# EAGLE schematic real_onboard_v8_v7 (EAGLE 9.7.0)

## Sheet 1 of 2
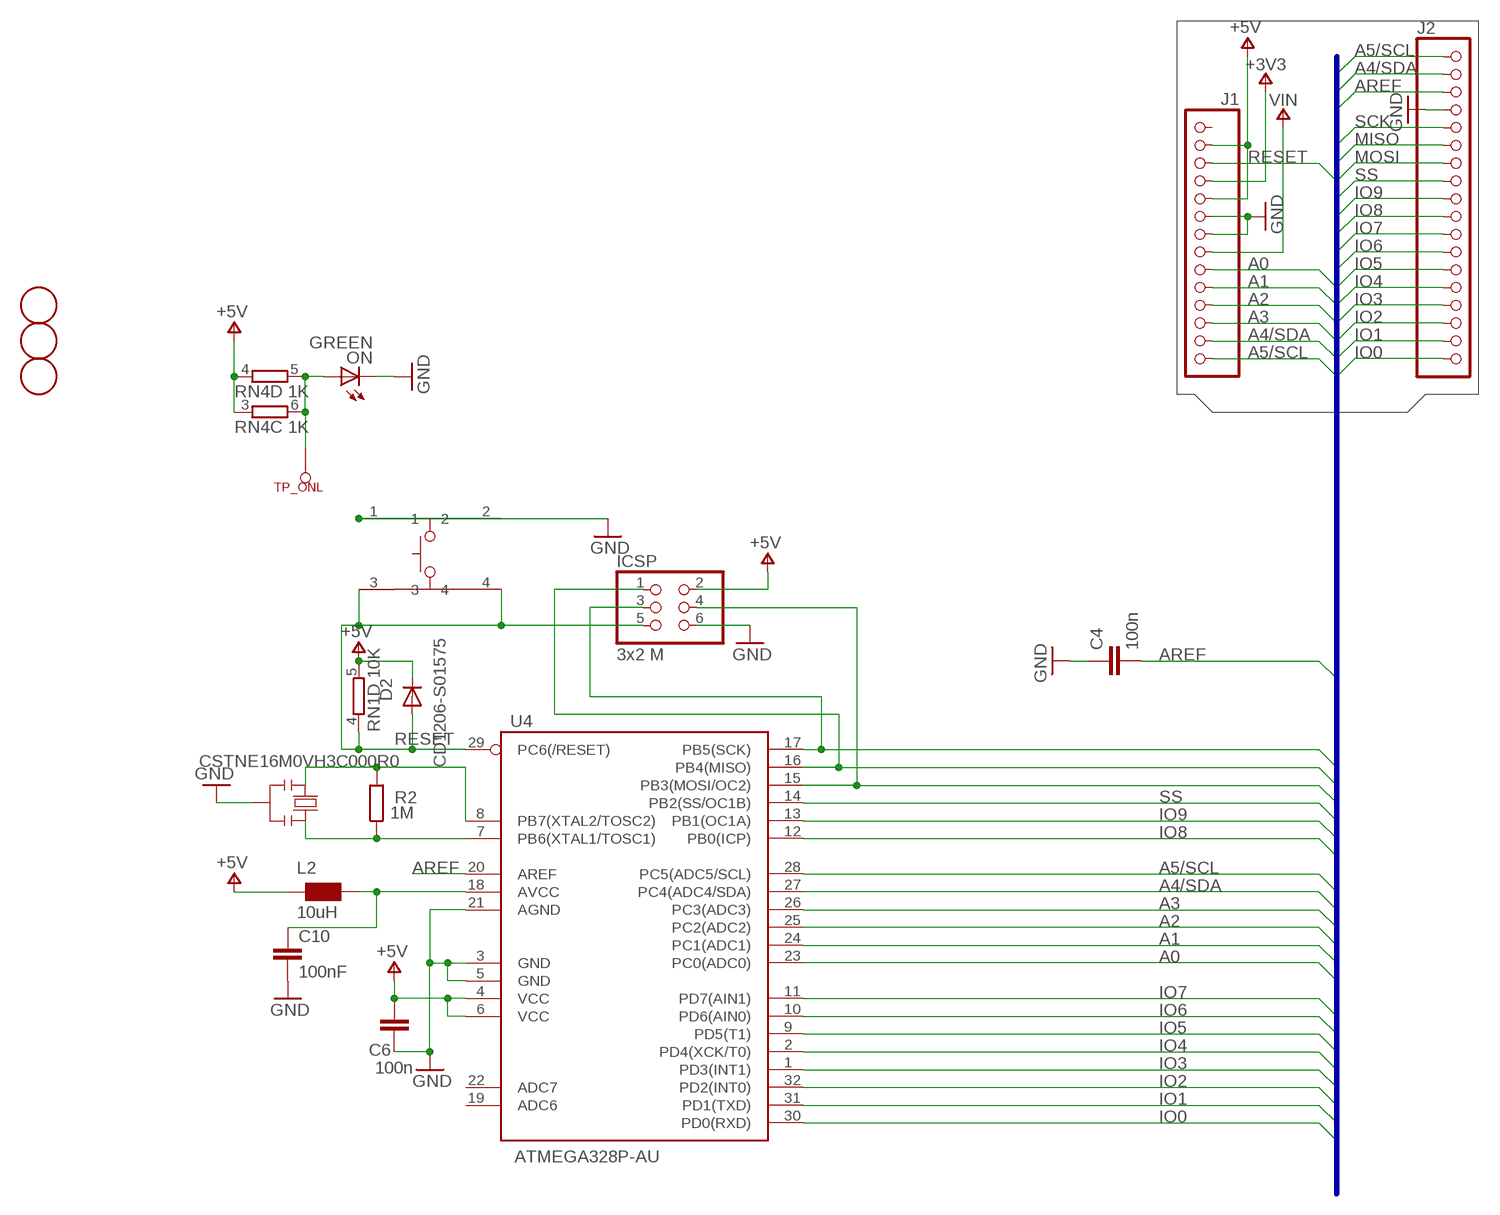
[diagram p0: schematic, sheet 1]

### Parts
C4  100n  C-EU0603-RND  [C0603-ROUND]
C6  100n  C-EU0603-RND  [C0603-ROUND]
C10  100nF  0015_100NF_0603  [C0603-ROUND]
D2  CD1206-S01575  DIODE-MINIMELF  [MINIMELF]
FD1  DNP  FIDUCIAL-1.5MM  [FD-1-1.5]
FD2  DNP  FIDUCIAL-1.5MM  [FD-1-1.5]
FD3  DNP  FIDUCIAL-1.5MM  [FD-1-1.5]
ICSP  3x2 M  PINHD-2X3  [2X03]
J1  -  PINHD-1X14-CUSTOM(PINHD-1X14)  [1X14-CUSTOM]
J2  PINHD-1X18-CUSTOM(PINHD-1X18)  [1X18-CUSTOM]
L2  10uH  0715_CV201210-100K  [0805]
ON  GREEN  LEDCHIP-LED0805  [CHIP-LED0805]
R2  1M  R-EU_R0603  [R0603-ROUND]
RESET  HX TS4550TP 250gf 009  HXTS4550TP250GF009  [HXTS4550TP250GF009]
RN1  10K  4R-NCAY16  [CAY16]
RN4  1K  4R-NCAY16  [CAY16]
TP_ONL  TP_SP  [TP-SP]
U4  ATMEGA328P-AU  ATMEGAXX8-AU  [TQFP32-08]
Y2  CSTNE16M0VH3C000R0  RESONATORMU  [RESONATOR]

### Nets
+3V3: J1.3V ; also sheet 2
+5V [usbvcc]: C6.2 D2.C ICSP.2 J1.5V J1.IOREF L2.1 RN1.5 RN4.3 RN4.4 U4.4(VCC) U4.6(VCC) ; also sheet 2
A0: J1.A0 U4.23(PC0(ADC0))
A1: J1.A1 U4.24(PC1(ADC1)) ; also sheet 2
A2: J1.A2 U4.25(PC2(ADC2)) ; also sheet 2
A3: J1.A3 U4.26(PC3(ADC3)) ; also sheet 2
A4/SDA: J1.A4 J2.SCL U4.27(PC4(ADC4/SDA))
A5/SCL: J1.A5 J2.SDA U4.28(PC5(ADC5/SCL))
AREF [aref]: C4.2 J2.AREF U4.20(AREF)
GND [gnd]: C4.1 C6.1 C10.2 ICSP.6 J1.GND1 J1.GND2 J2.GND ON.C RESET.1 RESET.2 U4.3(GND) U4.5(GND) U4.21(AGND) Y2.2 ; also sheet 2
IO0: J2.D0 U4.30(PD0(RXD))
IO1: J2.D1 U4.31(PD1(TXD))
IO2: J2.D2 U4.32(PD2(INT0))
IO3: J2.D3 U4.1(PD3(INT1)) ; also sheet 2
IO4: J2.D4 U4.2(PD4(XCK/T0)) ; also sheet 2
IO5: J2.D5 U4.9(PD5(T1)) ; also sheet 2
IO6: J2.D6 U4.10(PD6(AIN0)) ; also sheet 2
IO7: J2.D7 U4.11(PD7(AIN1)) ; also sheet 2
IO8: J2.D8 U4.12(PB0(ICP)) ; also sheet 2
IO9: J2.D9 U4.13(PB1(OC1A)) ; also sheet 2
MISO: ICSP.1 J2.D12 U4.16(PB4(MISO))
MOSI: ICSP.4 J2.D11 U4.15(PB3(MOSI/OC2))
N$3: ON.A RN4.5 RN4.6 TP_ONL.X(TESTP)
N$4 [usbvcc]: C10.1 L2.2 U4.18(AVCC)
RESET: D2.A ICSP.5 J1.RESET RESET.3 RESET.4 RN1.4 U4.29(PC6(/RESET))
SCK: ICSP.3 J2.D13 U4.17(PB5(SCK))
SS: J2.D10 U4.14(PB2(SS/OC1B)) ; also sheet 2
VIN [power]: J1.VIN
XTAL1: R2.1 U4.7(PB6(XTAL1/TOSC1)) Y2.3
XTAL2: R2.2 U4.8(PB7(XTAL2/TOSC2)) Y2.1
Unconnected: J1.RESERVED RN1.1 RN1.2 RN1.3 RN1.6 RN1.7 RN1.8 RN4.1 RN4.2 RN4.7 RN4.8 U4.19(ADC6) U4.22(ADC7)

### Buses
RESET

## Sheet 2 of 2
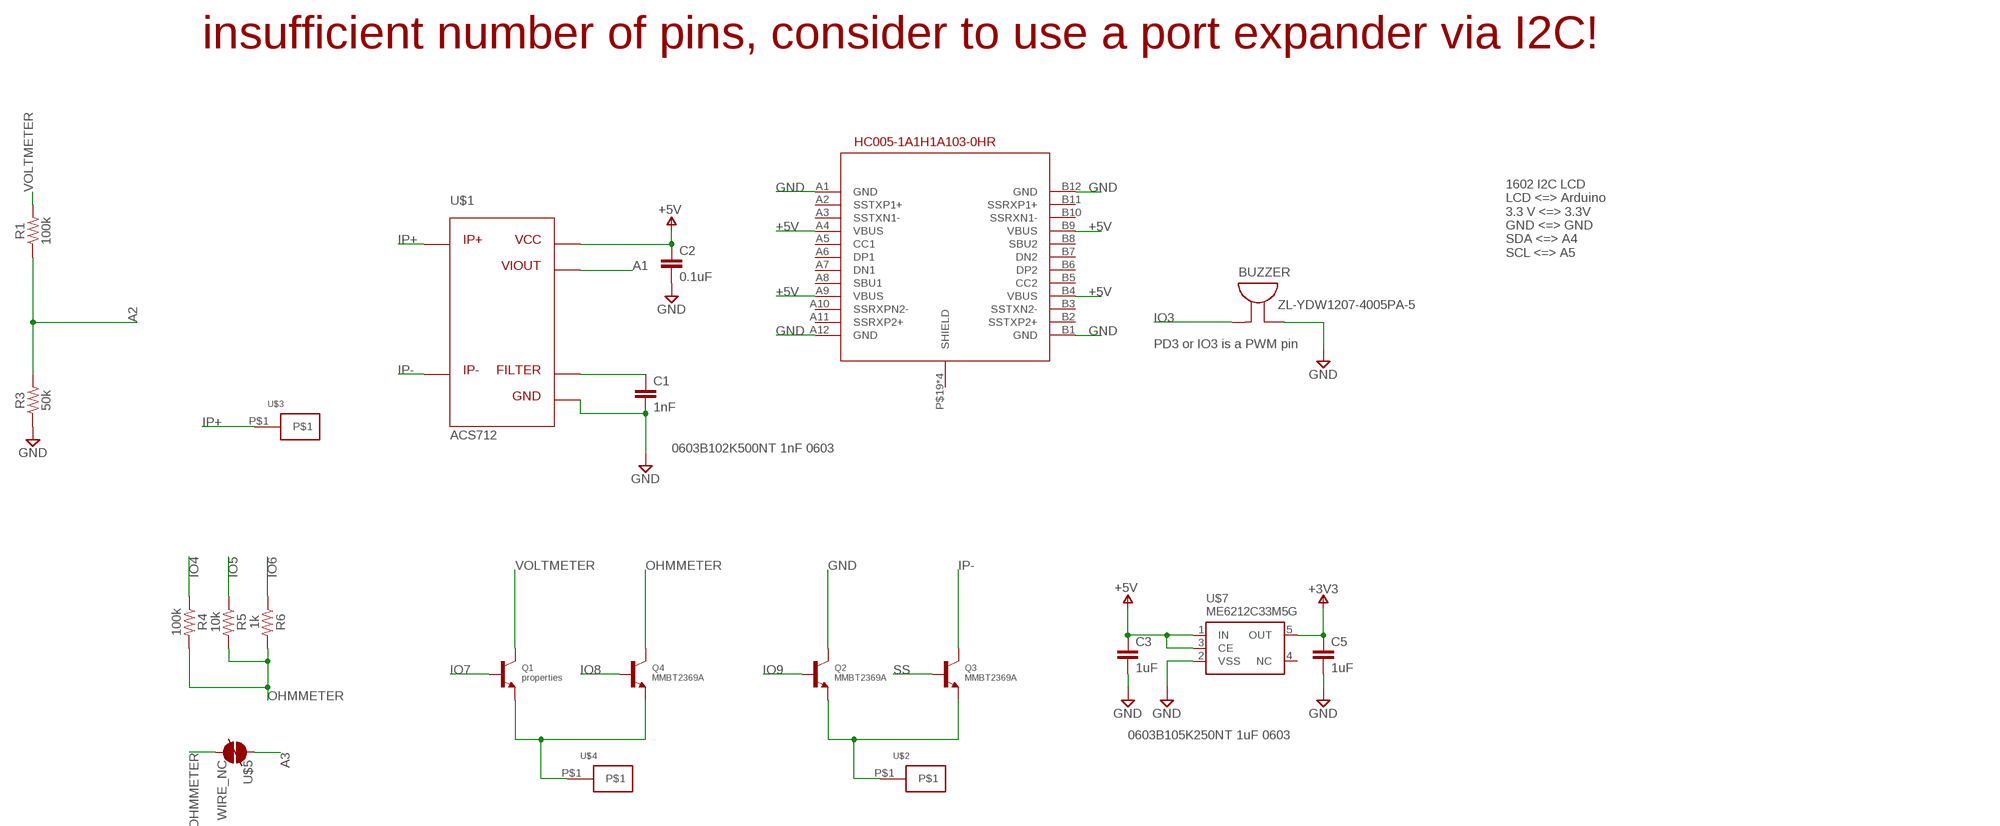
[diagram p1: schematic, sheet 2]

### Parts
BUZZER  ZL-YDW1207-4005PA-5  [PLUGIN,D=12.5MM]
C1  1nF  C-EUC0603  [C0603]
C2  0.1uF  C-EUC0603  [C0603]
C3  1uF  C-EUC0603  [C0603]
C5  1uF  C-EUC0603  [C0603]
Q1  properties  TRANSISTOR_NPNWIDE  [SOT23-WIDE]
Q2  MMBT2369A  TRANSISTOR_NPNWIDE  [SOT23-WIDE]
Q3  MMBT2369A  TRANSISTOR_NPNWIDE  [SOT23-WIDE]
Q4  MMBT2369A  TRANSISTOR_NPNWIDE  [SOT23-WIDE]
R1  100k  RESISTOR_DUAL_0603  [0603-THM]
R3  50k  RESISTOR_DUAL_0603  [0603-THM]
R4  100k  RESISTOR_DUAL_0603  [0603-THM]
R5  10k  RESISTOR_DUAL_0603  [0603-THM]
R6  1k  RESISTOR_DUAL_0603  [0603-THM]
U$1  ACS712  [SOIC-8]
U$2  24.247.2  24.247  [24.247]
U$3  24.247  [24.247]
U$4  24.247  [24.247]
U$5  WIRE_NC  [WIRE_NC]
U$6  HC005-1A1H1A103-0HR  [HC005-1A1H1A103-0HR]
U$7  ME6212C33M5G  ME6212  [SOT23-5]

### Nets
+3V3: C5.1 U$7.5(OUT) ; also sheet 1
+5V [usbvcc]: C2.1 C3.1 U$1.8 U$6.A4(VBUS) U$6.A9(VBUS) U$6.B4(VBUS) U$6.B9(VBUS) U$7.1(IN) U$7.3(CE) ; also sheet 1
A1: U$1.7 ; also sheet 1
A2: R1.1 R3.2 ; also sheet 1
A3: U$5.P$1 ; also sheet 1
GND [gnd]: BUZZER.2 C1.2 C2.2 C3.2 C5.2 Q2.3(C) R3.1 U$1.5 U$6.A1(GND) U$6.A12(GND) U$6.B1(GND) U$6.B12(GND) U$7.2(VSS) ; also sheet 1
IO3: BUZZER.1 ; also sheet 1
IO4: R4.1 ; also sheet 1
IO5: R5.1 ; also sheet 1
IO6: R6.1 ; also sheet 1
IO7: Q1.1(B) ; also sheet 1
IO8: Q4.1(B) ; also sheet 1
IO9: Q2.1(B) ; also sheet 1
IP+: U$1.1 U$1.2 U$3.P$1
IP-: Q3.3(C) U$1.3 U$1.4
N$1: Q2.2(E) Q3.2(E) U$2.P$1
N$5: C1.1 U$1.6
N$6: Q1.2(E) Q4.2(E) U$4.P$1
OHMMETER: Q4.3(C) R4.2 R5.2 R6.2 U$5.P$2
SS: Q3.1(B) ; also sheet 1
VOLTMETER: Q1.3(C) R1.2
Unconnected: U$6.A2(SSTXP1+) U$6.A3(SSTXN1-) U$6.A5(CC1) U$6.A6(DP1) U$6.A7(DN1) U$6.A8(SBU1) U$6.A10(SSRXPN2-) U$6.A11(SSRXP2+) U$6.B2(SSTXP2+) U$6.B3(SSTXN2-) U$6.B5(CC2) U$6.B6(DP2) U$6.B7(DN2) U$6.B8(SBU2) U$6.B10(SSRXN1-) U$6.B11(SSRXP1+) U$6.P$19(SHIELD) U$6.P$20(SHIELD) U$6.P$21(SHIELD) U$6.P$22(SHIELD) U$7.4(NC)

### Notes on the sheet
- insufficient number of pins, consider to use a port expander via I2C!
- 1602 I2C LCD
  LCD <=> Arduino
  3.3 V <=> 3.3V
  GND <=> GND
  SDA <=> A4
  SCL <=> A5
- PD3 or IO3 is a PWM pin
- 0603B102K500NT 1nF 0603
- 0603B105K250NT 1uF 0603

## Library data of the parts
BUZZER = louis:ZL-YDW1207-4005PA-5: Piezoelectric passive buzzer ZL-YDW1207-4005PA-5 4000 Hz Rated: 5V Current Consumption: 10 mA at 4000 Hz Square Wave 5Vp-p Note: In Arduino, use the tone() function to operate.
C1-C3 C5 = rcl:C-EU: CAPACITOR, European symbol; SPICEPREFIX: C
C4 C6 = SmartPrj:C-EU: CAPACITOR, European symbol
C10 = Condensatori:0015_100NF_0603: 100nF 0603; CASE: 0603; MONTHLY_USAGE: _____; PART_NUMBER: 100nF_0603; PRICE: _____; SUPPLIER: _____; TYPE: Condensatori
D2 = Diode:DIODE-: DIODE
FD1-FD3 = Arduino-utility:FIDUCIAL: Fiducial mount; DATASHEET: DNP; DISTRIBUTOR-LINK: DNP; DISTRIBUTOR-PN: DNP; MANUFACTURER: DNP; MANUFACTURER-PN: DNP
ICSP = SmartPrj:PINHD-2X3: PIN HEADER
J1 = louis:PINHD-1X14-CUSTOM(PINHD-1X14)
J2 = louis:PINHD-1X18-CUSTOM(PINHD-1X18)
L2 = Induttanze:0715_CV201210-100K: 10uH 0805; CASE: 0805; MONTHLY_USAGE: _____; PART_NUMBER: CV201210-100K; PRICE: _____; SUPPLIER: _____; TYPE: Induttanze
ON = LED:LED: LED OSRAM: - CHIPLED LG R971, LG N971, LY N971, LG Q971, LY Q971, LO R971, LY R971 LH N974, LH R974 LS Q976, LO Q976, LY Q976 LO Q996 - Hyper CHIPLED LW Q18S LB Q993, LB Q99A, LB R99A - SideLED LS A670, LO A670, LY A670, LG A670, LP A670 LB A673, LV A673, LT A673, LW A673 LH A674 LY A675 LS A676, LA A676, LO A676, LY A676, LW A676 LS A679, LY A679, LG A679 - Hyper Micro SIDELED® LS Y876, LA Y876, LO Y876, LY Y876 LT Y87S - SmartLED LW L88C, LW L88S LB L89C, LB L89S, LG L890 LS L89K, LO L89K, LY L89K LS L896, LA L896, LO L896, LY L896 - TOPLED LS T670, LO T670, LY T670, LG T670, LP T670 LSG T670, LSP T670, LSY T670, LOP T670, LYG T670 LG T671, LOG T671, LSG T671 LB T673, LV T673, LT T673, LW T673 LH T674 LS T676, LA T676, LO T676, LY T676, LB T676, LH T676, LSB T676, LW T676 LB T67C, LV T67C, LT T67C, LS T67K, LO T67K, LY T67K, LW E67C LS E67B, LA E67B, LO E67B, LY E67B, LB E67C, LV E67C, LT E67C LW T67C LS T679, LY T679, LG T679 LS T770, LO T770, LY T770, LG T770, LP T770 LB T773, LV T773, LT T773, LW T773 LH T774 LS E675, LA E675, LY E675, LS T675 LS T776, LA T776, LO T776, LY T776, LB T776 LHGB T686 LT T68C, LB T68C - Hyper Mini TOPLED® LB M676 - Mini TOPLED Santana® LG M470 LS M47K, LO M47K, LY M47K Source: http://www.osram.convergy.de LUXEON: - LUMILED® LXK2-PW12-R00, LXK2-PW12-S00, LXK2-PW14-U00, LXK2-PW14-V00 LXK2-PM12-R00, LXK2-PM12-S00, LXK2-PM14-U00 LXK2-PE12-Q00, LXK2-PE12-R00, LXK2-PE12-S00, LXK2-PE14-T00, LXK2-PE14-U00 LXK2-PB12-K00, LXK2-PB12-L00, LXK2-PB12-M00, LXK2-PB14-N00, LXK2-PB14-P00, LXK2-PB14-Q00 LXK2-PR12-L00, LXK2-PR12-M00, LXK2-PR14-Q00, LXK2-PR14-R00 LXK2-PD12-Q00, LXK2-PD12-R00, LXK2-PD12-S00 LXK2-PH12-R00, LXK2-PH12-S00 LXK2-PL12-P00, LXK2-PL12-Q00, LXK2-PL12-R00 Source: www.luxeon.com KINGBRIGHT: KA-3528ASYC Source: www.kingbright.com
Q1-Q4 = microbuilder (1):TRANSISTOR_NPN: NPN Transistor Transistor (NPN) 500mA 45V - BC817 [Digikey: 568-1631-1-ND] Transistor (NPN) 500mA 45V - BC817,215 [Mouser: 771-BC817-T/R] SOT23-R - SOT23 footprint optimised for use with solder paste and reflow ovens. SOT23-W - SOT23 footprint optimised for hand-soldering (larger pads).
R1 R3-R6 = louis-1:RESISTOR_DUAL_0603: Flip Flop resistor An 0805 resistor inside a standard 1/4W 5% resistor. Makes for easy mods Footprint taken from the Adafruit Industries Eagle Library.
R2 = SmartPrj:R-EU_: RESISTOR, European symbol
RESET = louis:HXTS4550TP250GF009
RN1 RN4 = resistor-dil:4R-N: Array Chip Resistor Source: RS Component / Phycomp
TP_ONL = SmartPrj:TP_SP
U4 = SmartPrj:ATMEGAXX8: MICROCONTROLLER 8 Kbytes FLASH 1 kbytes SRAM 512 bytes EEPROM USART 6-channel 10 bit ADC 2-channel 8 bit ADC Source: avr.lbr
U$1 = Library:ACS712
U$2-U$4 = louis:24.247: Banana Plug
U$5 = bawa:WIRE_NC
U$6 = louis-3:HC005-1A1H1A103-0HR
U$7 = louis:ME6212: ME6212 Fixed output voltage from 1.2V to 5.0V. ME6212C33M5G Vout = 3.3V ME6212C50M5G Vout = 5.0V
Y2 = SmartPrj:RESONATOR

## Net classes
0 default: width 0.254 mm, clearance 0.254 mm
1 power: width 0.61 mm, drill 0.61 mm, clearance 0.254 mm
2 gnd: width 0.305 mm, drill 0.559 mm, clearance 0.254 mm
3 usbvcc: width 0.508 mm, drill 0.61 mm, clearance 0.254 mm
4 aref: width 0.406 mm, drill 0.61 mm, clearance 0.254 mm